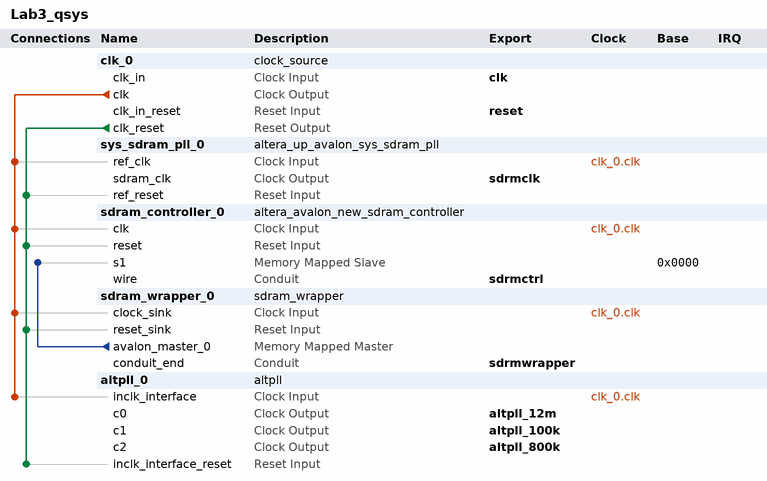
[diagram p0: system contents]
# Platform Designer (Qsys) system Lab3_qsys, Cyclone IV E EP4CE115F29C7
# Parameters at their usual value, and those the tool derives, are not listed.
package require -exact qsys 15.0
create_system Lab3_qsys
set_project_property DEVICE_FAMILY {Cyclone IV E}
set_project_property DEVICE EP4CE115F29C7

add_instance clk_0 clock_source 15.0
set_instance_parameter_value clk_0 clockFrequency 50000000

add_instance sys_sdram_pll_0 altera_up_avalon_sys_sdram_pll 15.0
set_instance_parameter_value sys_sdram_pll_0 CV_boards DE1-SoC
set_instance_parameter_value sys_sdram_pll_0 gui_outclk 50.0
set_instance_parameter_value sys_sdram_pll_0 gui_refclk 50.0

add_instance sdram_controller_0 altera_avalon_new_sdram_controller 15.0
set_instance_parameter_value sdram_controller_0 TAC 5.5
set_instance_parameter_value sdram_controller_0 TRCD 20.0
set_instance_parameter_value sdram_controller_0 TRP 20.0
set_instance_parameter_value sdram_controller_0 casLatency 3
set_instance_parameter_value sdram_controller_0 columnWidth 10
set_instance_parameter_value sdram_controller_0 dataWidth 32
set_instance_parameter_value sdram_controller_0 generateSimulationModel false
set_instance_parameter_value sdram_controller_0 model single_Micron_MT48LC4M32B2_7_chip
set_instance_parameter_value sdram_controller_0 numberOfBanks 4
set_instance_parameter_value sdram_controller_0 numberOfChipSelects 1
set_instance_parameter_value sdram_controller_0 powerUpDelay 100.0
set_instance_parameter_value sdram_controller_0 refreshPeriod 15.625
set_instance_parameter_value sdram_controller_0 rowWidth 13

add_instance sdram_wrapper_0 sdram_wrapper 1.0

add_instance altpll_0 altpll 15.0
set_instance_parameter_value altpll_0 CLK0_DIVIDE_BY 25
set_instance_parameter_value altpll_0 CLK0_MULTIPLY_BY 6
set_instance_parameter_value altpll_0 CLK1_DIVIDE_BY 500
set_instance_parameter_value altpll_0 CLK1_DUTY_CYCLE 50
set_instance_parameter_value altpll_0 CLK1_MULTIPLY_BY 1
set_instance_parameter_value altpll_0 CLK1_PHASE_SHIFT 0
set_instance_parameter_value altpll_0 CLK2_DIVIDE_BY 125
set_instance_parameter_value altpll_0 CLK2_DUTY_CYCLE 50
set_instance_parameter_value altpll_0 CLK2_MULTIPLY_BY 2
set_instance_parameter_value altpll_0 CLK2_PHASE_SHIFT 0
set_instance_parameter_value altpll_0 INCLK0_INPUT_FREQUENCY 20000
set_instance_parameter_value altpll_0 PORT_ARESET PORT_USED
set_instance_parameter_value altpll_0 PORT_LOCKED PORT_USED
set_instance_parameter_value altpll_0 PORT_clk1 PORT_USED
set_instance_parameter_value altpll_0 PORT_clk2 PORT_USED
set_instance_parameter_value altpll_0 PORT_clk3 PORT_UNUSED

# connections
add_connection clk_0.clk altpll_0.inclk_interface clock
add_connection clk_0.clk sdram_controller_0.clk clock
add_connection clk_0.clk sdram_wrapper_0.clock_sink clock
add_connection clk_0.clk sys_sdram_pll_0.ref_clk clock
add_connection clk_0.clk_reset altpll_0.inclk_interface_reset reset
add_connection clk_0.clk_reset sdram_controller_0.reset reset
add_connection clk_0.clk_reset sdram_wrapper_0.reset_sink reset
add_connection clk_0.clk_reset sys_sdram_pll_0.ref_reset reset
add_connection sdram_wrapper_0.avalon_master_0 sdram_controller_0.s1 avalon
set_connection_parameter_value sdram_wrapper_0.avalon_master_0/sdram_controller_0.s1 baseAddress 0x0000

# exported interfaces
add_interface altpll_100k clock source
set_interface_property altpll_100k EXPORT_OF altpll_0.c1
add_interface altpll_12m clock source
set_interface_property altpll_12m EXPORT_OF altpll_0.c0
add_interface altpll_800k clock source
set_interface_property altpll_800k EXPORT_OF altpll_0.c2
add_interface clk clock sink
set_interface_property clk EXPORT_OF clk_0.clk_in
add_interface reset reset sink
set_interface_property reset EXPORT_OF clk_0.clk_in_reset
add_interface sdrmclk clock source
set_interface_property sdrmclk EXPORT_OF sys_sdram_pll_0.sdram_clk
add_interface sdrmctrl conduit end
set_interface_property sdrmctrl EXPORT_OF sdram_controller_0.wire
add_interface sdrmwrapper conduit end
set_interface_property sdrmwrapper EXPORT_OF sdram_wrapper_0.conduit_end

set_interconnect_requirement {$system} qsys_mm.clockCrossingAdapter HANDSHAKE
set_interconnect_requirement {$system} qsys_mm.enableEccProtection FALSE
set_interconnect_requirement {$system} qsys_mm.insertDefaultSlave FALSE
set_interconnect_requirement {$system} qsys_mm.maxAdditionalLatency 1

save_system Lab3_qsys.qsys
